# Altium schematic sheet TVR_Rev2_Power.SchDoc
size A4; SheetNumber: 3; SheetTotal: 4
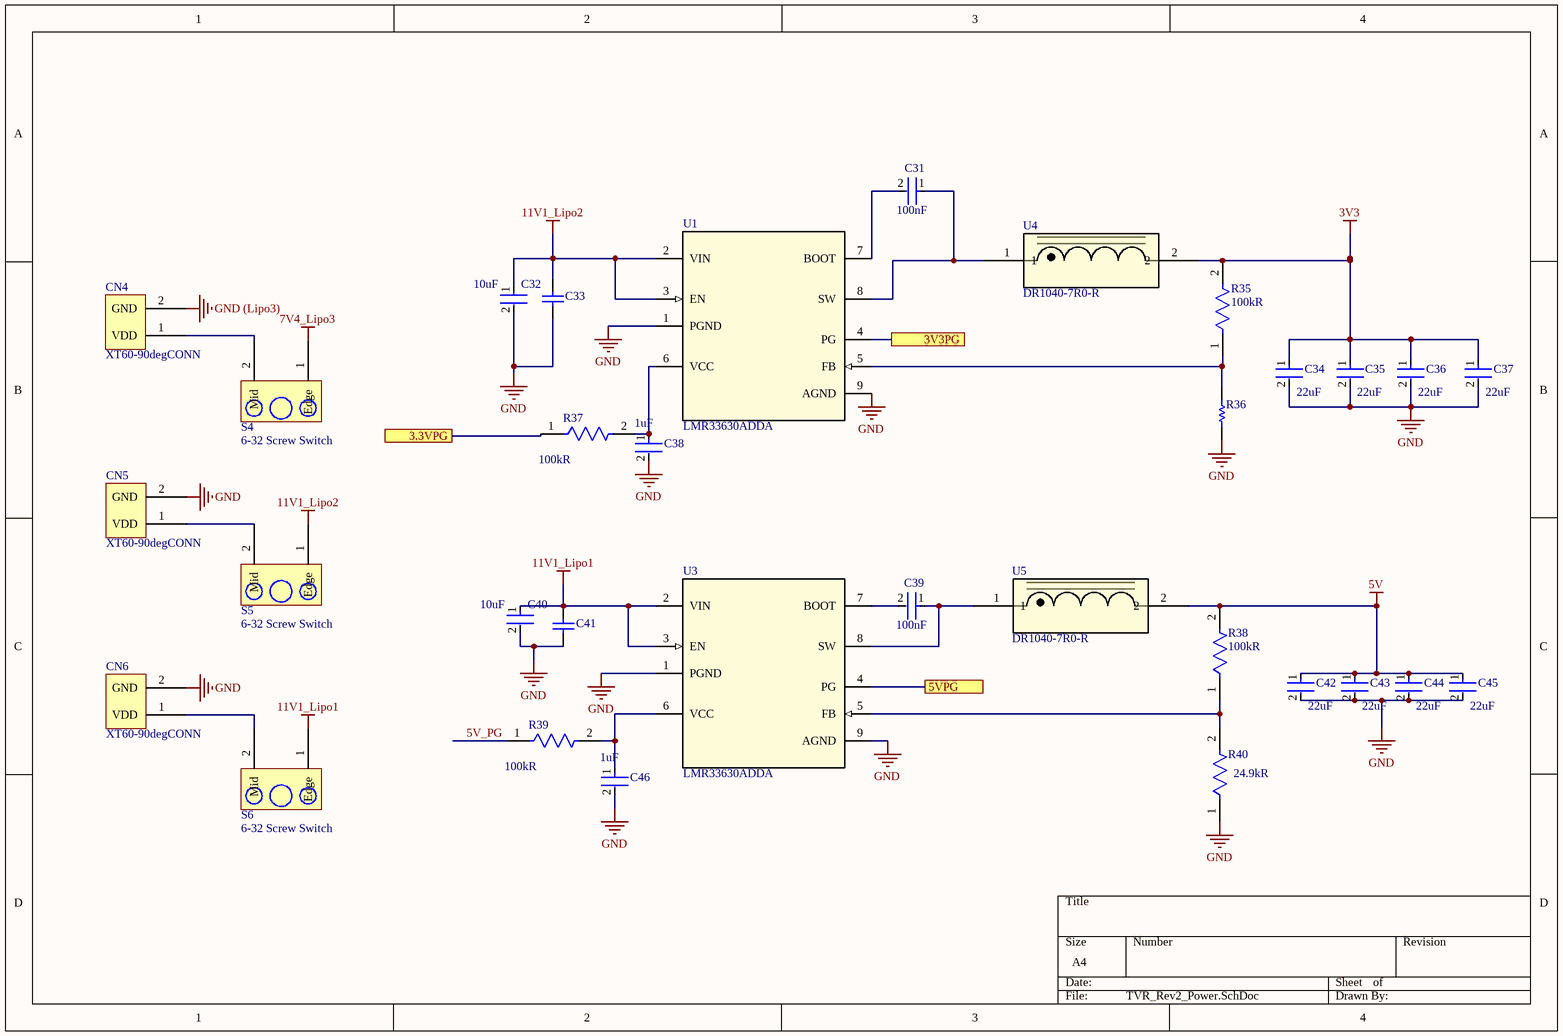
[diagram p0: TVR_Rev2_Power.SchDoc]

## Parts
C31  Capacitance: 100nF  [FP-C2012-125-0_45-MFG]  (hidden comment: C2012X7T2E104K125AE)
C32  Capacitance: 10uF  [FP-GRM21B-0_15-IPC_C]  (hidden comment: GRM21BR61E106KA73L)
C33  08051C224KAT2A  [CAPC2013X94X50ML20T25]  (value not drawn)
C34  Capacitance: 22uF  [FP-CL21-IPC_A]  (hidden comment: CL21A226KOQNNNG)
C35  Capacitance: 22uF  [FP-CL21-IPC_A]  (hidden comment: CL21A226KOQNNNG)
C36  Capacitance: 22uF  [FP-CL21-IPC_A]  (hidden comment: CL21A226KOQNNNG)
C37  Capacitance: 22uF  [FP-CL21-IPC_A]  (hidden comment: CL21A226KOQNNNG)
C38  Capacitance: 1uF  [FP-C2012-125-IPC_B]  (hidden comment: C2012X7S2A105K125AE)
C39  Capacitance: 100nF  [FP-C2012-125-0_45-MFG]  (hidden comment: C2012X7T2E104K125AE)
C40  Capacitance: 10uF  [FP-GRM21B-0_15-IPC_C]  (hidden comment: GRM21BR61E106KA73L)
C41  08051C224KAT2A  [CAPC2013X94X50ML20T25]  (value not drawn)
C42  Capacitance: 22uF  [FP-CL21-IPC_A]  (hidden comment: CL21A226KOQNNNG)
C43  Capacitance: 22uF  [FP-CL21-IPC_A]  (hidden comment: CL21A226KOQNNNG)
C44  Capacitance: 22uF  [FP-CL21-IPC_A]  (hidden comment: CL21A226KOQNNNG)
C45  Capacitance: 22uF  [FP-CL21-IPC_A]  (hidden comment: CL21A226KOQNNNG)
C46  Capacitance: 1uF  [FP-C2012-125-IPC_B]  (hidden comment: C2012X7S2A105K125AE)
CN4  XT60-90degCONN  [XT60-90CONN]
CN5  XT60-90degCONN  [XT60-90CONN]
CN6  XT60-90degCONN  [XT60-90CONN]
R35  Resistance: 100kR  [FP-RC0805-0_6-IPC_C]  (hidden comment: RC0805FR-07100KL)
R36  RC0805FR-0743K2L  [RESC2013X60X35NL10T20]  (value not drawn)
R37  Resistance: 100kR  [FP-RC0805-0_6-IPC_C]  (hidden comment: RC0805FR-07100KL)
R38  Resistance: 100kR  [FP-RC0805-0_6-IPC_C]  (hidden comment: RC0805FR-07100KL)
R39  Resistance: 100kR  [FP-RC0805-0_6-IPC_C]  (hidden comment: RC0805FR-07100KL)
R40  Resistance: 24.9kR  [FP-RMCF1210-MFG]  (hidden comment: RMCF1210FT24K9)
S4  6-32 Screw Switch  [6-32 Screw Switch]
S5  6-32 Screw Switch  [6-32 Screw Switch]
S6  6-32 Screw Switch  [6-32 Screw Switch]
U1  LMR33630ADDA  [DDA0008J]
U3  LMR33630ADDA  [DDA0008J]
U4  DR1040-7R0-R  [DR1040-7R0-R_EAT]
U5  DR1040-7R0-R  [DR1040-7R0-R_EAT]

## Ports
3.3VPG, 3V3PG, 5VPG

## Nets
3V3: C34.1 C35.1 C36.1 C37.1 R35.2 U4.2
5V: C42.1 C43.1 C44.1 C45.1 R38.2 U5.2
7V4_Lipo3: S4.1(Edge)
11V1_Lipo1: C40.1 C41.2 S6.1(Edge) U3.2(VIN) U3.3(EN)
11V1_Lipo2: C32.1 C33.2 S5.1(Edge) U1.2(VIN) U1.3(EN)
GND: C32.2 C33.1 C34.2 C35.2 C36.2 C37.2 C38.2 C40.2 C41.1 C42.2 C43.2 C44.2 C45.2 C46.2 CN5.2(GND) CN6.2(GND) R36.1 R40.1 U1.1(PGND) U1.9(AGND) U3.1(PGND) U3.9(AGND)
GND (Lipo3): CN4.2(GND)
3.3VPG: R37.1 ; port 3.3VPG
3V3PG: U1.4(PG) ; port 3V3PG
5V_PG: R39.1
5VPG: U3.4(PG) ; port 5VPG
NetC31_1: C31.1 U1.8(SW) U4.1
NetC31_2: C31.2 U1.7(BOOT)
NetC38_1: C38.1 R37.2 U1.6(VCC)
NetC39_1: C39.1 U3.8(SW) U5.1
NetC39_2: C39.2 U3.7(BOOT)
NetC46_1: C46.1 R39.2 U3.6(VCC)
NetCN4_1: CN4.1(VDD) S4.2(Mid)
NetCN5_1: CN5.1(VDD) S5.2(Mid)
NetCN6_1: CN6.1(VDD) S6.2(Mid)
NetR35_1: R35.1 R36.2 U1.5(FB)
NetR38_1: R38.1 R40.2 U3.5(FB)

## Library data of the parts
C31 C39 = CMP-08246-004341-1: CAP CER 0.1UF 250V X7T 0805; Tolerance: 10%; Case Code (Metric): 2012; Package Quantity: 1; Max Operating Temperature: 125°C; Thickness: 0.049inch; Case Code (Imperial): 0805; Features: Soft Termination; Length: 2mm; Weight: 0.000194oz; Min Operating Temperature: -55°C; Case/Package: 0805; Mount: Surface Mount; REACH SVHC: No SVHC; Dielectric: X7T; Voltage Rating: 250V; Width: 0.05inch; Series: C; Packaging: Tape and Reel; Depth: 1.25mm; Resistor Type: Ceramic; Voltage Rating (DC): 250V; Height: 1.25mm; Termination: SMD/SMT; RoHS Compliant: Yes
C32 C40 = CMP-2007-03541-2: Chip Multilayer Ceramic Capacitors for General Purpose, 0805, 10uF, X5R, 15%, 10%, 25V; Length: 2mm; Depth: 1.25mm; Termination: SMD/SMT; Voltage: 25V; Height: 1.25mm; Material: Ceramic; Thickness: 0.053inch; Radiation Hardening: No; Min Operating Temperature: -55°C; Width: 0.049inch; Package Quantity: 1; Mount: Surface Mount; Dielectric: X5R; Packaging: Tape and Reel; Voltage Rating (DC): 25V; Lead Free: Lead Free; Max Operating Temperature: 85°C; Case Code (Imperial): 0805; Case/Package: 0805; Tolerance: 10%; Voltage Rating: 25V; Case Code (Metric): 2012
C33 C41 = CMP-2007-04189-1: Manufacturer: AVX Interconnect / Elco; Part Number: 08051C224KAT2A
C34-C37 C42-C45 = CMP-13271-000211-1: CL21 Series 0805 22uF 16V ±10% Tolerance X5R Multilayer Ceramic Chip Capacitor; Max Operating Temperature: 85°C; Width: 0.049inch; Tolerance: 10%; Thickness: 0.055inch; Mount: Surface Mount; Case/Package: 0805; Lead Free: Lead Free; Packaging: Tape and Reel; Voltage Rating: 16V; Package Quantity: 3000; Min Operating Temperature: -55°C; Length: 0.079inch
C38 C46 = CMP-08246-004333-1: CAP CER 1UF 100V X7S 0805; Tolerance: 10%; Case Code (Metric): 2012; Resistor Type: Ceramic; Voltage Rating (DC): 100V; RoHS Compliant: Yes; Mount: Surface Mount; Min Operating Temperature: -55°C; Voltage Rating: 100V; Series: C; Width: 0.05inch; Max Operating Temperature: 125°C; Height: 1.25mm; Length: 2mm; Dielectric: X7S; Case/Package: 0805; Packaging: Tape and Reel; Features: Soft Termination; Lead Free: Lead Free; Case Code (Imperial): 0805; Thickness: 0.049inch; Termination: SMD/SMT; Package Quantity: 1; Depth: 1.25mm
R35 R37-R39 = CMP-2100-03668-5: RES 100K OHM 1% 1/8W 0805; Power Rating: 125mW; Temperature Coefficient: 100ppm/°C; Voltage Rating (DC): 150V; Package Quantity: 1; Case/Package: 0805; Lead Pitch: 0.4mm; Case Code (Imperial): 0805; Construction: Rectangular; Number of Terminations: 2; RoHS Compliant: Yes; Max Power Dissipation: 125mW; Tolerance: 1%; Max Operating Temperature: 155°C; Resistance Tolerance: 1%; Lead Free: Lead Free; Packaging: Tape and Reel; Resistor Type: Thick Film; Min Operating Temperature: -55°C; Case Code (Metric): 2012; Series: RC; Technology: THICK FILM; Voltage Rating: 150V; Termination: SMD/SMT; Width: 0.049inch; Number of Pins: 2; Features: Moisture Resistant; Military Standard: Not; Length: 0.079inch; Depth: 1.25mm; Size Code: 0805; Height: 0.024inch
R36 = CMP-2001-01147-1: Manufacturer: Yageo; Part Number: RC0805FR-0743K2L
R40 = CMP-26527-004872-1: 24.9kΩ ±1% 0.5W 1210 Thick Film Chip Resistor AEC-Q200 compliant; Temperature Coefficient: 100ppm/°C; Max Power Dissipation: 333mW; Length: 0.126inch; Mount: Surface Mount; Width: 0.098inch; Resistor Type: Thick Film; Packaging: Tape and Reel; RoHS Compliant: Yes; Series: RMCF; Max Operating Temperature: 155°C; Case/Package: 1210; Radiation Hardening: No; Number of Terminations: 2; Contact Plating: Tin; Case Code (Metric): 3225; Features: Automotive AEC-Q200; Height: 0.028inch; Tolerance: 1%; Package Quantity: 1; Min Operating Temperature: -55°C; Case Code (Imperial): 1210
U1 U3 = LMR33630ADDA: No Description Available; Mfr_Name: Texas Instruments; TYPE: TYPE; RefDes: RefDes
U4 U5 = DR1040-7R0-R: No Description Available; Mfr_Name: Eaton / Coiltronics; RefDes: RefDes; Type: Type